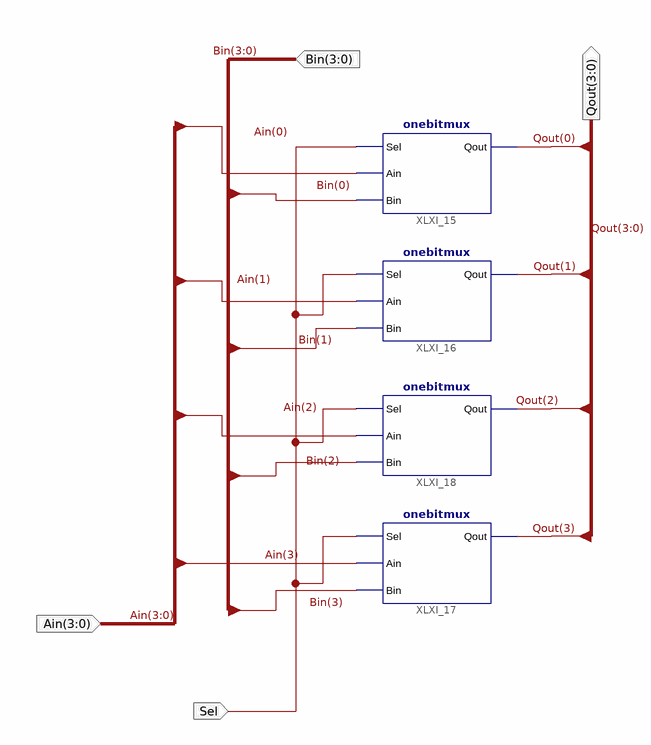
[diagram p0: schematic sheet 1]
// Xilinx ISE schematic fourbitmux.sch (spartan3e) as structural Verilog: 4 symbols, 4 ports
module fourbitmux (
  input  [3:0] Ain,
  input  [3:0] Bin,
  input  Sel,
  output [3:0] Qout
);

  onebitmux XLXI_15 (.Sel(Sel), .Ain(Ain[0]), .Bin(Bin[0]), .Qout(Qout[0]));
  onebitmux XLXI_16 (.Sel(Sel), .Ain(Ain[1]), .Bin(Bin[1]), .Qout(Qout[1]));
  onebitmux XLXI_17 (.Sel(Sel), .Ain(Ain[3]), .Bin(Bin[3]), .Qout(Qout[3]));
  onebitmux XLXI_18 (.Sel(Sel), .Ain(Ain[2]), .Bin(Bin[2]), .Qout(Qout[2]));
endmodule
